# EAGLE design Voicecard-SMR-v04 (EAGLE 5.09)
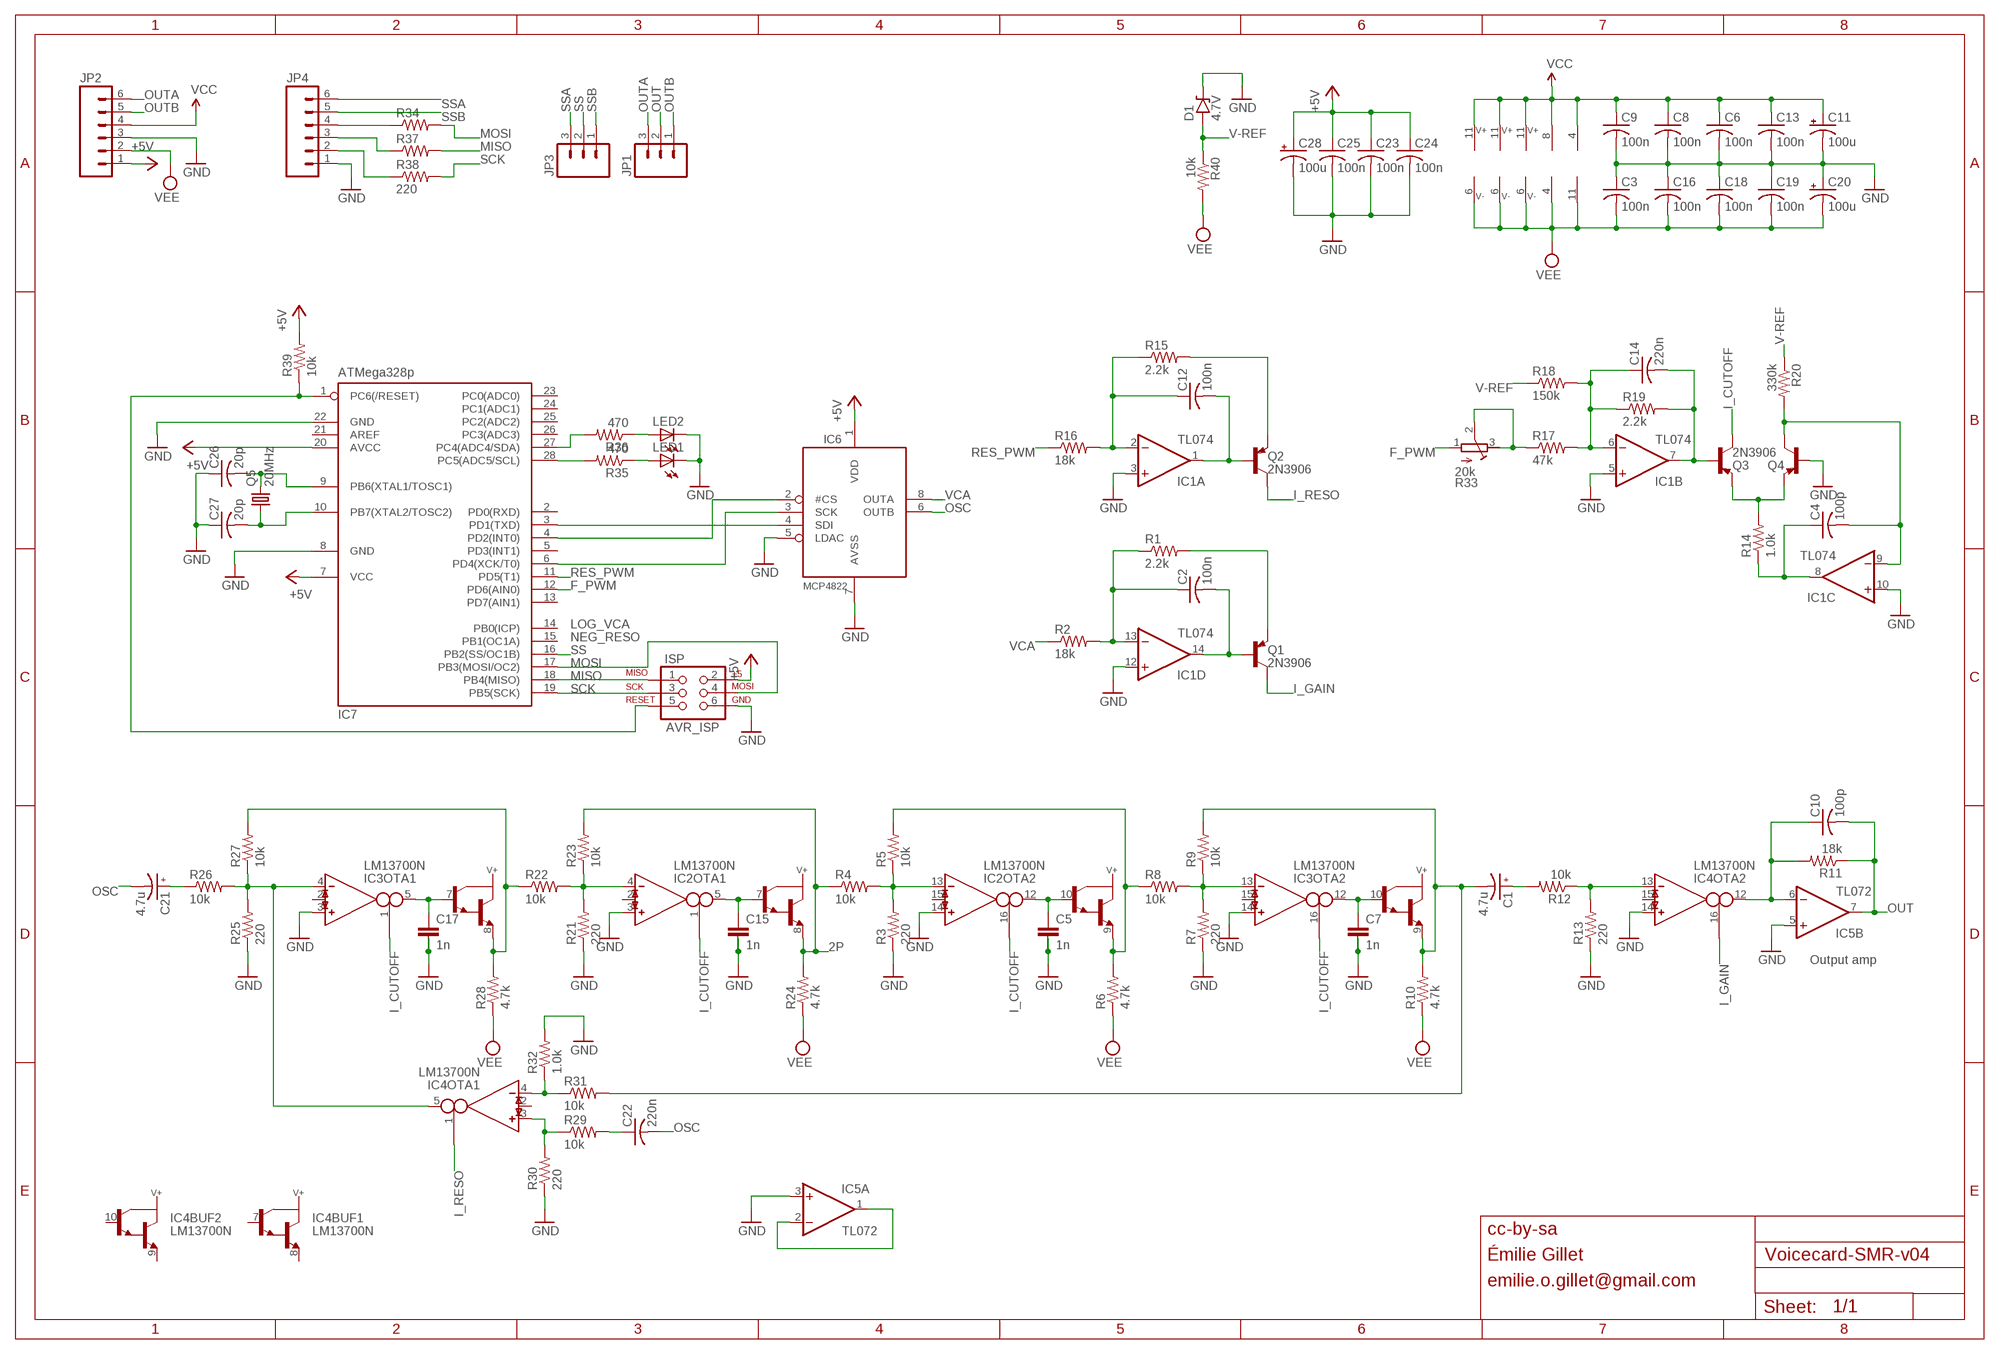
[diagram p0: schematic, sheet 1]

## Parts
C1  4.7u  CPOL-USE11-6.3  [E11-6.3]
C2  100n  C-US025-025X050  [C025-025X050]
C3  100n  C-US025-025X050  [C025-025X050]
C4  100p  C-US025-025X050  [C025-025X050]
C5  1n  C-2.5-5/2  [C2.5/5-2]
C6  100n  C-US025-025X050  [C025-025X050]
C7  1n  C-2.5-5/2  [C2.5/5-2]
C8  100n  C-US025-025X050  [C025-025X050]
C9  100n  C-US025-025X050  [C025-025X050]
C10  100p  C-US025-025X050  [C025-025X050]
C11  100u  CPOL-USE2.5-6  [E2,5-6]
C12  100n  C-US025-025X050  [C025-025X050]
C13  100n  C-US025-025X050  [C025-025X050]
C14  220n  C-US025-025X050  [C025-025X050]
C15  1n  C-2.5-5/2  [C2.5/5-2]
C16  100n  C-US025-025X050  [C025-025X050]
C17  1n  C-2.5-5/2  [C2.5/5-2]
C18  100n  C-US025-025X050  [C025-025X050]
C19  100n  C-US025-025X050  [C025-025X050]
C20  100u  CPOL-USE2.5-6  [E2,5-6]
C21  4.7u  CPOL-USE11-6.3  [E11-6.3]
C22  220n  C-US025-025X050  [C025-025X050]
C23  100n  C-US025-025X050  [C025-025X050]
C24  100n  C-US025-025X050  [C025-025X050]
C25  100n  C-US025-024X044  [C025-024X044]
C26  20p  C-US025-024X044  [C025-024X044]
C27  20p  C-US025-024X044  [C025-024X044]
C28  100u  CPOL-USE2.5-6  [E2,5-6]
D1  4.7V  1N47XXDO35  [D-5]
IC1  TL074  TL084P  [DIL14]
IC2  LM13700N  [DIL16]
IC3  LM13700N  [DIL16]
IC4  LM13700N  [DIL16]
IC5  TL072  TL072P  [DIL08]
IC6  MCP4822  [DIL08]
IC7  ATMega328p  MEGA8-P  [DIL28-3]
ISP  AVR_ISP  AVR_SPI_PRG_6PTH  [2X3]
JP1  M03PTH  [1X03]
JP2  M06SIP  [1X06]
JP3  M03PTH  [1X03]
JP4  M06SIP  [1X06]
LED1  LED3MM  [LED3MM]
LED2  LED3MM  [LED3MM]
Q1  2N3906  2N3906-  [TO92-]
Q2  2N3906  2N3906-  [TO92-]
Q3  2N3906  2N3906-  [TO92-]
Q4  2N3906  2N3906-  [TO92-]
Q5  20MHz  CRYSTALHC49U-V  [HC49U-V]
R1  2.2k  R-US_0204/7  [0204/7]
R2  18k  R-US_0204/7  [0204/7]
R3  220  R-US_0204/7  [0204/7]
R4  10k  R-US_0204/7  [0204/7]
R5  10k  R-US_0204/7  [0204/7]
R6  4.7k  R-US_0204/7  [0204/7]
R7  220  R-US_0204/7  [0204/7]
R8  10k  R-US_0204/7  [0204/7]
R9  10k  R-US_0204/7  [0204/7]
R10  4.7k  R-US_0204/7  [0204/7]
R11  18k  R-US_0204/7  [0204/7]
R12  10k  R-US_0204/7  [0204/7]
R13  220  R-US_0204/7  [0204/7]
R14  1.0k  R-US_0204/7  [0204/7]
R15  2.2k  R-US_0204/7  [0204/7]
R16  18k  R-US_0204/7  [0204/7]
R17  47k  R-US_0204/7  [0204/7]
R18  150k  R-US_0204/7  [0204/7]
R19  2.2k  R-US_0204/7  [0204/7]
R20  330k  R-US_0204/7  [0204/7]
R21  220  R-US_0204/7  [0204/7]
R22  10k  R-US_0204/7  [0204/7]
R23  10k  R-US_0204/7  [0204/7]
R24  4.7k  R-US_0204/7  [0204/7]
R25  220  R-US_0204/7  [0204/7]
R26  10k  R-US_0204/7  [0204/7]
R27  10k  R-US_0204/7  [0204/7]
R28  4.7k  R-US_0204/7  [0204/7]
R29  10k  R-US_0204/7  [0204/7]
R30  220  R-US_0204/7  [0204/7]
R31  10k  R-US_0204/7  [0204/7]
R32  1.0k  R-US_0204/7  [0204/7]
R33  20k  R-TRIMM3296P  [RTRIM3296P]
R34  220  R-US_0204/7  [0204/7]
R35  470  R-US_0204/7  [0204/7]
R36  470  R-US_0204/7  [0204/7]
R37  220  R-US_0204/7  [0204/7]
R38  220  R-US_0204/7  [0204/7]
R39  10k  R-US_0204/7  [0204/7]
R40  10k  R-US_0204/7  [0204/7]

## Nets
2P: IC2.8(BUF1:E) R4.1 R23.2 R24.2
4P: C1.- IC3.9(BUF2:E) R9.2 R10.2 R31.2
+5V: C23.1 C24.1 C25.1 C28.+ IC6.1(VDD) IC7.7(VCC) IC7.20(AVCC) ISP.2 JP2.1 R39.2
F_PWM: IC7.12(PD6(AIN0)) R33.1(E)
GND: C3.1 C5.2 C5.3 C6.2 C7.2 C7.3 C8.2 C9.2 C11.- C13.2 C15.2 C15.3 C16.1 C17.2 C17.3 C18.1 C19.1 C20.+ C23.2 C24.2 C25.2 C26.1 C27.1 C28.- D1.C IC1.3(A:+IN) IC1.5(B:+IN) IC1.10(C:+IN) IC1.12(D:+IN) IC2.3(OTA1:IN_P) IC2.14(OTA2:IN_P) IC3.3(OTA1:IN_P) IC3.14(OTA2:IN_P) IC4.14(OTA2:IN_P) IC5.3(A:+IN) IC5.5(B:+IN) IC6.5(LDAC) IC6.7(AVSS) IC7.8(GND) IC7.22(GND) ISP.6 JP2.3 JP4.1 LED1.K(C) LED2.K(C) Q4.2(B) R3.1 R7.1 R13.1 R21.1 R25.1 R30.1 R32.2
I_CUTOFF: IC2.1(OTA1:I_BIAS) IC2.16(OTA2:I_BIAS) IC3.1(OTA1:I_BIAS) IC3.16(OTA2:I_BIAS) Q3.1(C)
I_GAIN: IC4.16(OTA2:I_BIAS) Q1.1(C)
I_RESO: IC4.1(OTA1:I_BIAS) Q2.1(C)
MISO: IC7.18(PB4(MISO)) ISP.1 R37.2
MOSI: IC7.17(PB3(MOSI/OC2)) ISP.4 R34.2
N$1: Q3.3(E) Q4.3(E) R14.2
N$2: C14.2 IC1.7(B:OUT) Q3.2(B) R19.2
N$3: IC6.4(SDI) IC7.3(PD1(TXD))
N$4: C4.2 IC1.9(C:-IN) Q4.1(C) R20.2
N$5: C21.+ R26.1
N$6: IC3.8(BUF1:E) R22.1 R27.2 R28.2
N$7: LED1.A R35.1
N$8: JP4.2 R38.1
N$9: C4.1 IC1.8(C:OUT) R14.1
N$10: LED2.A R36.1
N$11: IC7.27(PC4(ADC4/SDA)) R36.2
N$12: IC3.4(OTA1:IN_N) IC4.5(OTA1:OUT) R25.2 R26.2 R27.1
N$13: JP4.3 R37.1
N$14: IC7.1(PC6(/RESET)) ISP.5 R39.1
N$15: IC6.3(SCK) IC7.6(PD4(XCK/T0))
N$16: IC6.2(#CS) IC7.4(PD2(INT0))
N$17: IC2.4(OTA1:IN_N) R21.2 R22.2 R23.1
N$18: JP4.4 R34.1
N$19: C15.1 IC2.5(OTA1:OUT) IC2.7(BUF1:B)
N$20: IC7.28(PC5(ADC5/SCL)) R35.2
N$21: IC2.13(OTA2:IN_N) R3.2 R4.2 R5.1
N$22: IC5.1(A:OUT) IC5.2(A:-IN)
N$23: C5.1 IC2.10(BUF2:B) IC2.12(OTA2:OUT)
N$24: IC3.13(OTA2:IN_N) R7.2 R8.2 R9.1
N$26: IC2.9(BUF2:E) R5.2 R6.2 R8.1
N$27: C1.+ R12.2
N$28: C7.1 IC3.10(BUF2:B) IC3.12(OTA2:OUT)
N$29: IC4.4(OTA1:IN_N) R31.1 R32.1
N$30: C12.2 IC1.1(A:OUT) Q2.2(B)
N$31: C2.2 IC1.14(D:OUT) Q1.2(B)
N$32: C22.1 R29.2
N$33: IC4.3(OTA1:IN_P) R29.1 R30.2
N$34: IC4.13(OTA2:IN_N) R12.1 R13.2
N$40: C14.1 IC1.6(B:-IN) R17.2 R18.2 R19.1
N$41: R17.1 R33.2(S) R33.3(A)
N$51: C2.1 IC1.13(D:-IN) R1.1 R2.2
N$57: C12.1 IC1.2(A:-IN) R15.1 R16.2
N$60: Q2.3(E) R15.2
N$64: C17.1 IC3.5(OTA1:OUT) IC3.7(BUF1:B)
N$68: Q1.3(E) R1.2
N$70: C10.1 IC4.12(OTA2:OUT) IC5.6(B:-IN) R11.2
N$82: C27.2 IC7.10(PB7(XTAL2/TOSC2)) Q5.1
N$83: C26.2 IC7.9(PB6(XTAL1/TOSC1)) Q5.2
OSC: C21.- C22.2 IC6.6(OUTB)
OUT: C10.2 IC5.7(B:OUT) JP1.2 R11.1
OUTA: JP1.3 JP2.6
OUTB: JP1.1 JP2.5
RES_PWM: IC7.11(PD5(T1)) R16.1
SCK: IC7.19(PB5(SCK)) ISP.3 R38.2
SS: IC7.16(PB2(SS/OC1B)) JP3.2
SSA: JP3.3 JP4.6
SSB: JP3.1 JP4.5
V-REF: D1.A R18.1 R20.1 R40.1
VCA: IC6.8(OUTA) R2.1
VCC: C6.1 C8.1 C9.1 C11.+ C13.1 IC1.4(P:V+) IC2.11(SUPPLY:V+) IC3.11(SUPPLY:V+) IC4.11(SUPPLY:V+) IC5.8(P:V+) JP2.4
VEE: C3.2 C16.2 C18.2 C19.2 C20.- IC1.11(P:V-) IC2.6(SUPPLY:V-) IC3.6(SUPPLY:V-) IC4.6(SUPPLY:V-) IC5.4(P:V-) JP2.2 R6.1 R10.1 R24.1 R28.1 R40.2
Unconnected: IC2.2(OTA1:I_DIODE) IC2.15(OTA2:I_DIODE) IC3.2(OTA1:I_DIODE) IC3.15(OTA2:I_DIODE) IC4.2(OTA1:I_DIODE) IC4.7(BUF1:B) IC4.8(BUF1:E) IC4.9(BUF2:E) IC4.10(BUF2:B) IC4.15(OTA2:I_DIODE) IC7.2(PD0(RXD)) IC7.5(PD3(INT1)) IC7.13(PD7(AIN1)) IC7.14(PB0(ICP)) IC7.15(PB1(OC1A)) IC7.21(AREF) IC7.23(PC0(ADC0)) IC7.24(PC1(ADC1)) IC7.25(PC2(ADC2)) IC7.26(PC3(ADC3))

## Notes on the sheet
- LOG_VCA
- NEG_RESO
- Output amp
- cc-by-sa
- Émilie Gillet
- emilie.o.gillet@gmail.com

## Library data of the parts
C1 C21 = og-rcl:CPOL-US
C2-C4 C6 C8-C10 C12-C14 C16 C18 C19 C22-C27 = rcl:C-US: CAPACITOR, American symbol
C5 C7 C15 C17 = capacitor-wima:C-: CAPACITOR for alternative placement naming: default grid - extended grid/package width
C11 C20 C28 = rcl:CPOL-US: POLARIZED CAPACITOR, American symbol
D1 = og-diodes:1N47XX: Zener Diode 1N4728 - 1N4764: 3.3 V - 100V, 10% (1n47xxA 5%); DO-41 glass case
IC1 = linear:TL084: OP AMP
IC2-IC4 = ota:LM13700: Dual OTA with buffers
IC5 = gm-ics:TL072: OP AMP
IC6 = og-dac:MCP4822
IC7 = atmel:MEGA8-P: MICROCONTROLLER 8 Kbytes FLASH, 1 kbytes SRAM, 512 bytes EEPROM, USART, 4-channel 10 bit ADC, 2-channel 8 bit ADC Pin compatible with Atmega48, ATMega88, ATMega168 Source: avr.lbr
ISP = SparkFun:AVR_SPI_PRG_6: AVR ISP 6 Pin This is the reduced ISP connector for AVR programming. Common on Arduino. This footprint will take up less PCB space and can be used with a 10-pin to 6-pin adapter such as SKU: BOB-08508
JP1 JP3 = SparkFun:M03: Header 3 Standard 3-pin 0.1" header. Use with straight break away headers (SKU : PRT-00116), right angle break away headers (PRT-00553), swiss pins (PRT-00743), machine pins (PRT-00117), and female headers (PRT-00115). Molex polarized connector foot print use with SKU : PRT-08232 with associated crimp pins and housings.
JP2 JP4 = SparkFun:M06: Header 6 Standard 6-pin 0.1" header. Use with straight break away headers (SKU : PRT-00116), right angle break away headers (PRT-00553), swiss pins (PRT-00743), machine pins (PRT-00117), and female headers (PRT-00115). Molex polarized connector foot print use with SKU : PRT-08094 with associated crimp pins and housings. NOTES ON THE VARIANTS LOCK and LOCK_LONGPADS... This footprint was designed to help hold the alignment of a through-hole component (i.e. 6-pin header) while soldering it into place. You may notice that each hole has been shifted either up or down by 0.005 of an inch from it's more standard position (which is a perfectly straight line). This slight alteration caused the pins (the squares in the middle) to touch the edges of the holes. Because they are alternating, it causes a "brace" to hold the component in place. 0.005 has proven to be the perfect amount of "off-center" position when using our standard breakaway headers. Although looks a little odd when you look at the bare footprint, once you have a header in there, the alteration is very hard to notice. Also, if you push a header all the way into place, it is covered up entirely on the bottom side. This idea of altering the position of holes to aid alignment will be further integrated into the Sparkfun Library for other footprints. It can help hold any component with 3 or more connection pins.
LED1 LED2 = led:LED: LED OSRAM: - CHIPLED LG R971, LG N971, LY N971, LG Q971, LY Q971, LO R971, LY R971 LH N974, LH R974 LS Q976, LO Q976, LY Q976 LO Q996 - Hyper CHIPLED LW Q18S LB Q993, LB Q99A, LB R99A - SideLED LS A670, LO A670, LY A670, LG A670, LP A670 LB A673, LV A673, LT A673, LW A673 LH A674 LY A675 LS A676, LA A676, LO A676, LY A676, LW A676 LS A679, LY A679, LG A679 - Hyper Micro SIDELED® LS Y876, LA Y876, LO Y876, LY Y876 LT Y87S - SmartLED LW L88C, LW L88S LB L89C, LB L89S, LG L890 LS L89K, LO L89K, LY L89K LS L896, LA L896, LO L896, LY L896 - TOPLED LS T670, LO T670, LY T670, LG T670, LP T670 LSG T670, LSP T670, LSY T670, LOP T670, LYG T670 LG T671, LOG T671, LSG T671 LB T673, LV T673, LT T673, LW T673 LH T674 LS T676, LA T676, LO T676, LY T676, LB T676, LH T676, LSB T676, LW T676 LB T67C, LV T67C, LT T67C, LS T67K, LO T67K, LY T67K, LW E67C LS E67B, LA E67B, LO E67B, LY E67B, LB E67C, LV E67C, LT E67C LW T67C LS T679, LY T679, LG T679 LS T770, LO T770, LY T770, LG T770, LP T770 LB T773, LV T773, LT T773, LW T773 LH T774 LS E675, LA E675, LY E675, LS T675 LS T776, LA T776, LO T776, LY T776, LB T776 LHGB T686 LT T68C, LB T68C - Hyper Mini TOPLED® LB M676 - Mini TOPLED Santana® LG M470 LS M47K, LO M47K, LY M47K Source: http://www.osram.convergy.de LUXEON: - LUMILED® LXK2-PW12-R00, LXK2-PW12-S00, LXK2-PW14-U00, LXK2-PW14-V00 LXK2-PM12-R00, LXK2-PM12-S00, LXK2-PM14-U00 LXK2-PE12-Q00, LXK2-PE12-R00, LXK2-PE12-S00, LXK2-PE14-T00, LXK2-PE14-U00 LXK2-PB12-K00, LXK2-PB12-L00, LXK2-PB12-M00, LXK2-PB14-N00, LXK2-PB14-P00, LXK2-PB14-Q00 LXK2-PR12-L00, LXK2-PR12-M00, LXK2-PR14-Q00, LXK2-PR14-R00 LXK2-PD12-Q00, LXK2-PD12-R00, LXK2-PD12-S00 LXK2-PH12-R00, LXK2-PH12-S00 LXK2-PL12-P00, LXK2-PL12-Q00, LXK2-PL12-R00 Source: www.luxeon.com KINGBRIGHT: KA-3528ASYC Source: www.kingbright.com
Q1-Q4 = gm-trans:2N3906: PNP Transistor
Q5 = crystal:CRYSTAL: CRYSTAL
R1-R32 R34-R40 = rcl:R-US_: RESISTOR, American symbol
R33 = rcl:R-TRIMM: Trimm resistor

## Board
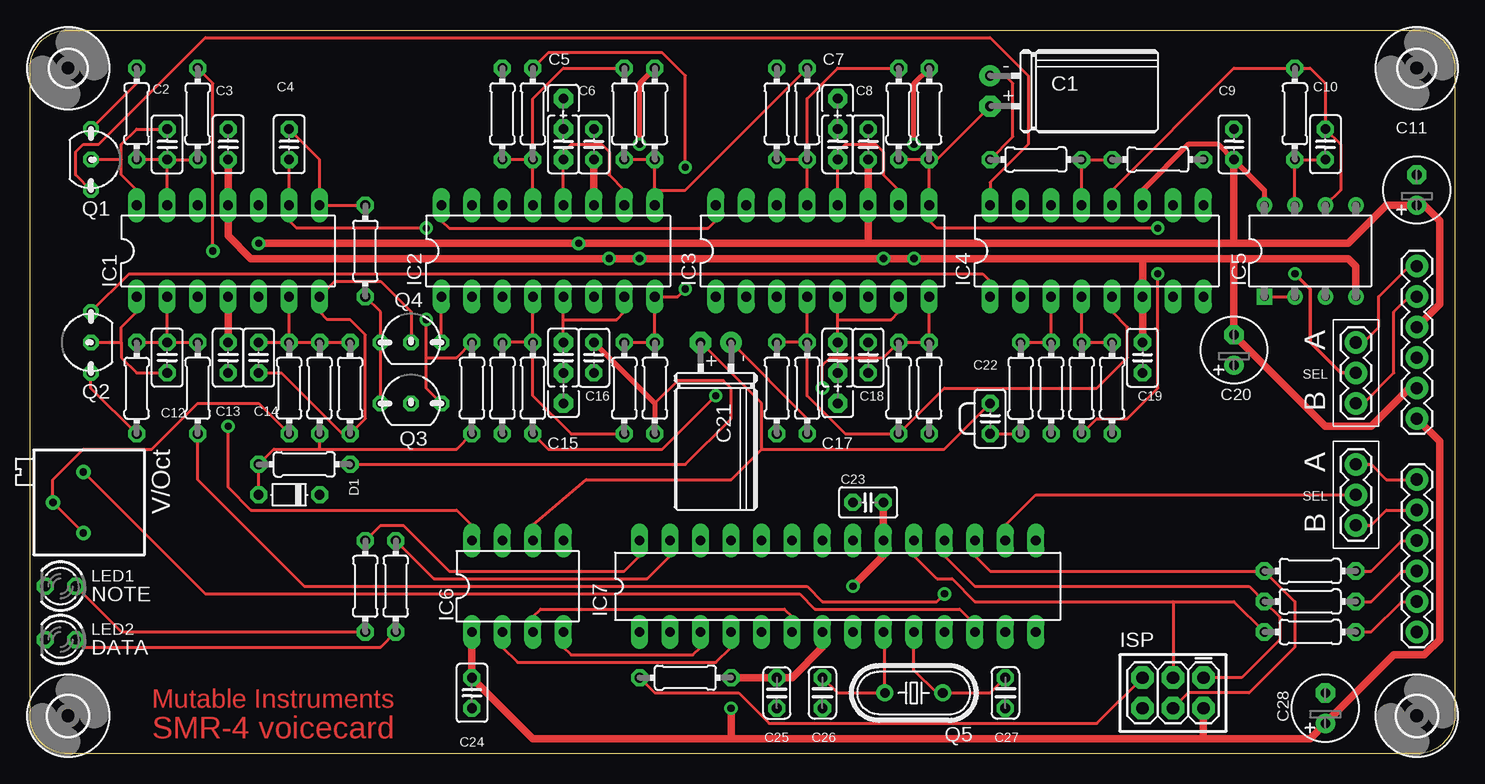
[diagram p1: board, top side]
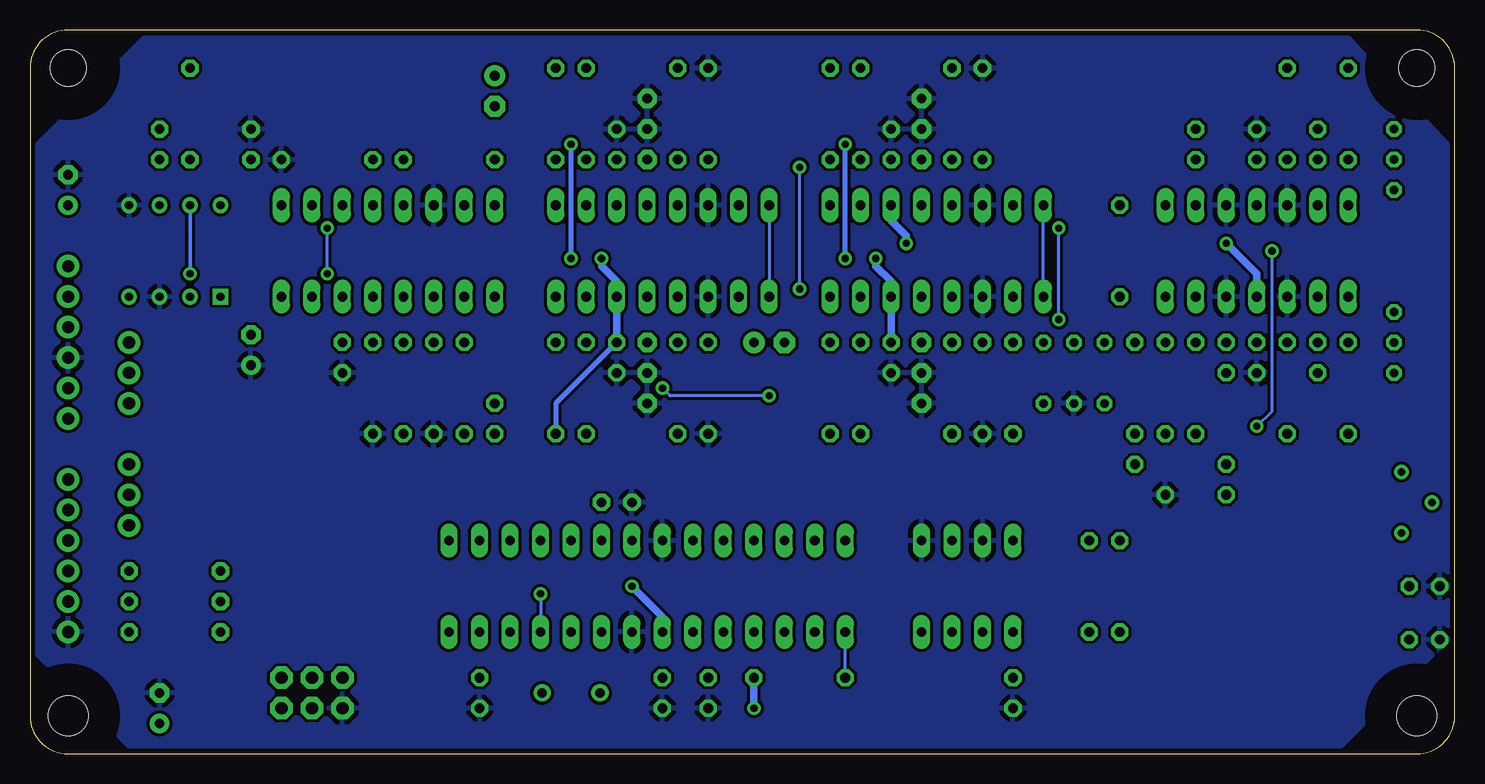
[diagram p2: board, bottom side, seen from below]

Size 118.75 x 60.33 mm. Coordinates in mm from the lower left corner, seen from the top.
Outline: 0,57.15 arc-90 3.17,60.33 115.57,60.33 arc-90 118.75,57.15 118.75,3.17 arc-90 115.57,0 3.17,0 arc-90 0,3.17 0,57.15
Copper layers (1*16): Top 0.035mm / dielectric 1.5mm / Bottom 0.035mm
Design rules "SparkFun *": minimum track width 8mil, minimum drill 20mil, track to track 8mil, track to pad 8mil, pad to pad 8mil, via to via 8mil, smd to smd 8mil, copper to edge 10mil, drill to drill 8mil, minimum pad ring 12mil, minimum via ring 10mil, stop-mask expansion 4mil, vias tented up to drill 25mil, thermal gap 16mil

### Footprints (pad centres in the part's own frame; a part is rotated, then mirrored left to right if it is on the bottom)
E11-6.3 = drill 0.813 pad 1.778 round: + -2.54,1.27 | drill 0.813 pad 1.778 octagon: - -2.54,-1.27
C025-025X050 = drill 0.813 octagon: 1 -1.27,0; 2 1.27,0
C2.5/5-2 = drill 0.813 pad 1.6 octagon: 1 -1.27,0; 2 1.27,0; 3 3.81,0
E2,5-6 = drill 0.813 pad 1.6 round: + -1.27,0 | drill 0.813 pad 1.6 octagon: - 1.27,0
C025-024X044 = drill 0.813 octagon: 1 -1.27,0; 2 1.27,0
D-5 = drill 0.813 octagon: A 2.54,0; C -2.54,0
DIL14 = drill 0.813 long: 1 -7.62,-3.81; 2 -5.08,-3.81; 3 -2.54,-3.81; 4 0,-3.81; 5 2.54,-3.81; 6 5.08,-3.81; 7 7.62,-3.81; 8 7.62,3.81; 9 5.08,3.81; 10 2.54,3.81; 11 0,3.81; 12 -2.54,3.81; 13 -5.08,3.81; 14 -7.62,3.81
DIL16 = drill 0.813 long: 1 -8.89,-3.81; 2 -6.35,-3.81; 3 -3.81,-3.81; 4 -1.27,-3.81; 5 1.27,-3.81; 6 3.81,-3.81; 7 6.35,-3.81; 8 8.89,-3.81; 9 8.89,3.81; 10 6.35,3.81; 11 3.81,3.81; 12 1.27,3.81; 13 -1.27,3.81; 14 -3.81,3.81; 15 -6.35,3.81; 16 -8.89,3.81
DIL08 = drill 0.7 square: 1 -3.81,-3.81 | drill 0.7 round: 2 -1.27,-3.81; 3 1.27,-3.81; 4 3.81,-3.81; 5 3.81,3.81; 6 1.27,3.81; 7 -1.27,3.81; 8 -3.81,3.81
DIL08' = drill 0.813 long: 1 -3.81,-3.81; 2 -1.27,-3.81; 3 1.27,-3.81; 4 3.81,-3.81; 5 3.81,3.81; 6 1.27,3.81; 7 -1.27,3.81; 8 -3.81,3.81
DIL28-3 = drill 0.813 long: 1 -16.51,-3.81; 2 -13.97,-3.81; 3 -11.43,-3.81; 4 -8.89,-3.81; 5 -6.35,-3.81; 6 -3.81,-3.81; 7 -1.27,-3.81; 8 1.27,-3.81; 9 3.81,-3.81; 10 6.35,-3.81; 11 8.89,-3.81; 12 11.43,-3.81; 13 13.97,-3.81; 14 16.51,-3.81; 15 16.51,3.81; 16 13.97,3.81; 17 11.43,3.81; 18 8.89,3.81; 19 6.35,3.81; 20 3.81,3.81; 21 1.27,3.81; 22 -1.27,3.81; 23 -3.81,3.81; 24 -6.35,3.81; 25 -8.89,3.81; 26 -11.43,3.81; 27 -13.97,3.81; 28 -16.51,3.81
2X3 = drill 1.016 pad 1.88 octagon: 1 0,0; 2 0,2.54; 3 2.54,0; 4 2.54,2.54; 5 5.08,0; 6 5.08,2.54
1X03 = drill 1.016 pad 1.88 round: 1 0,0; 2 2.54,0; 3 5.08,0
1X06 = drill 1.016 pad 1.88 round: 1 0,0; 2 2.54,0; 3 5.08,0; 4 7.62,0; 5 10.16,0; 6 12.7,0
LED3MM = drill 0.813 octagon: A -1.27,0; K 1.27,0
TO92- = drill 0.7 octagon: 1 2.54,0; 2 0,0; 3 -2.54,0
HC49U-V = drill 0.813 round: 1 -2.413,0; 2 2.413,0
0204/7 = drill 0.813 octagon: 1 -3.81,0; 2 3.81,0
RTRIM3296P = drill 0.61 round: 1 0,-2.54; 2 2.54,0; 3 0,2.54
3,0 = hole 3: 0,0
3,3 = hole 3.3: 0,0

### Placement (x,y rotation side)
C1  82.55,55.25 0 top
C2  11.43,50.8 90 top
C3  16.51,50.8 270 top
C4  21.59,50.8 270 top
C5  44.45,50.8 90 top
C6  46.99,50.8 90 top
C7  67.31,50.8 90 top
C8  69.85,50.8 90 top
C9  100.33,50.8 90 top
C10  107.95,50.8 270 top
C11  115.57,46.99 90 top
C12  11.43,33.02 270 top
C13  16.51,33.02 270 top
C14  19.05,33.02 270 top
C15  44.45,33.02 270 top
C16  46.99,33.02 90 top
C17  67.31,33.02 270 top
C18  69.85,33.02 90 top
C19  92.71,33.02 90 top
C20  100.33,33.66 90 top
C21  57.15,31.75 270 top
C22  80.01,27.94 90 top
C23  69.85,20.95 180 top
C24  36.83,5.08 270 top
C25  62.23,5.08 270 top
C26  66.04,5.08 90 top
C27  81.28,5.08 90 top
C28  107.95,3.81 90 top
D1  21.59,21.59 180 top
IC1  16.51,41.91 0 top
IC2  43.18,41.91 0 top
IC3  66.04,41.91 0 top
IC4  88.9,41.91 0 top
IC5  106.68,41.91 0 top
IC6  MCP4822  [DIL08']  40.64,13.97 0 top
IC7  67.31,13.97 0 top
ISP  97.79,6.35 180 top
JP1  110.49,29.21 90 top
JP2  115.57,27.94 90 top
JP3  110.49,19.05 90 top
JP4  115.57,10.16 90 top
LED1  2.54,13.97 180 top
LED2  2.54,9.53 180 top
Q1  5.08,49.53 270 top
Q2  5.08,34.29 90 top
Q3  31.75,34.29 0 top
Q4  31.75,29.21 0 top
Q5  73.66,5.08 180 top
R1  8.89,53.34 90 top
R2  13.97,53.34 270 top
R3  39.37,53.34 270 top
R4  41.91,53.34 270 top
R5  49.53,53.34 270 top
R6  52.07,53.34 270 top
R7  62.23,53.34 270 top
R8  64.77,53.34 270 top
R9  72.39,53.34 270 top
R10  74.93,53.34 270 top
R11  105.41,53.34 90 top
R12  83.82,49.53 180 top
R13  93.98,49.53 180 top
R14  27.94,41.91 270 top
R15  8.89,30.48 270 top
R16  13.97,30.48 90 top
R17  21.59,30.48 90 top
R18  24.13,30.48 90 top
R19  26.67,30.48 270 top
R20  36.83,30.48 90 top
R21  39.37,30.48 90 top
R22  41.91,30.48 90 top
R23  49.53,30.48 90 top
R24  52.07,30.48 90 top
R25  62.23,30.48 90 top
R26  64.77,30.48 90 top
R27  72.39,30.48 90 top
R28  74.93,30.48 90 top
R29  82.55,30.48 270 top
R30  85.09,30.48 90 top
R31  87.63,30.48 270 top
R32  90.17,30.48 270 top
R33  4.45,20.95 180 top
R34  106.68,15.24 180 top
R35  27.94,13.97 90 top
R36  30.48,13.97 90 top
R37  106.68,12.7 180 top
R38  106.68,10.16 180 top
R39  54.61,6.35 0 top
R40  22.86,24.13 0 top
U$1  [3,0]  3.17,57.15 0 top
U$2  [3,0]  115.57,57.15 0 top
U$4  [3,3]  3.17,3.17 0 top
U$5  [3,3]  115.57,3.17 0 top
U$6  [V2_LOGO_SMALL]  8.26,-3.81 0 top  (outside the outline)

### Tracks (layer width: path | path; a pad name or v marks a point on that pad's centre or on a via)
2P  (via drill 0.6)
  Top 0.254: R23.2 R24.2 IC2.8 53.98,38.1 v54.61,38.74 | R4.1 43.18,58.42 52.7,58.42 54.61,56.52 v54.61,48.9
  Bottom 0.254: v54.61,38.74 v54.61,48.9
4P  (via drill 0.6)
  Top 0.254: R10.2 R9.2 | R10.2 IC3.9 74.93,44.45 75.56,43.82 v93.98,43.82 | R10.2 74.93,50.17 | v93.98,40.01 93.98,30.48 91.44,27.94 88.9,27.94 R31.2 | R10.2 75.56,49.53 C1.-
  Bottom 0.254: v93.98,40.01 v93.98,43.82
+5V  (via drill 0.6)
  Top 0.61: 58.42,1.27 41.91,1.27 C24.1 IC6.1 | 58.42,1.27 v58.42,3.81 | 58.42,1.27 97.79,1.27 | 97.79,1.27 106.68,1.27 C28.+ 113.67,8.26 116.2,8.26 117.47,9.53 117.47,26.04 JP2.1 | R39.2 C25.1 63.5,6.35 66.04,8.89 IC7.7 | v68.58,13.97 71.12,16.51 IC7.20 C23.1 | 97.79,1.27 ISP.2
  Bottom 0.61: v58.42,3.81 R39.2 | IC7.7 66.04,11.43 v68.58,13.97
F_PWM
  Top 0.254: IC7.12 78.74,10.79 77.47,12.06 65.41,12.06 64.14,13.33 14.61,13.33 R33.1
GND
  pour Bottom (isolate 0.254): 8.89,59.69 0.64,50.8 0.64,9.53 9.53,0.64 110.49,0.64 118.11,8.26 118.11,50.8 109.22,59.69
I_CUTOFF
  Top 0.254: Q3.1 IC2.1 | IC3.16 57.15,44.45 56.52,43.82 34.92,43.82 34.29,44.45 IC2.16
  Bottom 0.254: IC3.16 IC3.1 | IC2.1 IC2.16
I_GAIN
  Top 0.254: Q1.1 3.81,48.26 3.81,50.17 4.45,50.8 5.71,50.8 14.61,59.69 80.01,59.69 83.19,56.52 83.19,50.8 80.01,47.62 IC4.16 80.01,46.99
I_RESO
  Top 0.254: IC4.1 80.01,39.37 79.38,40.01 8.26,40.01 Q2.1
MISO
  Top 0.254: IC7.18 76.2,16.51 78.74,13.97 101.6,13.97 R37.2 104.14,11.43 104.14,9.53 100.97,6.35 ISP.1
MOSI
  Top 0.254: IC7.17 78.74,16.51 80.01,15.24 R34.2 105.41,12.7 105.41,8.89 101.6,5.08 96.52,5.08 ISP.4
N$1
  Top 0.254: Q4.3 Q3.3 29.21,36.83 R14.2
N$2
  Top 0.254: C14.2 20.95,31.75 26.04,26.67 R19.2 27.94,27.94 27.94,34.93 26.67,36.2 24.77,36.2 24.13,36.83 IC1.7 25.4,39.37 29.21,39.37 31.75,36.83 Q3.2
N$3
  Top 0.254: IC7.3 55.88,8.89 55.24,8.26 45.09,8.26 44.45,8.89 IC6.4
N$4  (via drill 0.6)
  Top 0.254: C4.2 IC1.9 21.59,44.45 22.23,43.82 v33.02,43.82 | Q4.1 33.02,30.48 33.02,33.02 | 33.02,33.02 v33.02,36.2 | R20.2 35.56,33.02 33.02,33.02
  Bottom 0.254: v33.02,36.2 v33.02,43.82
N$5
  Top 0.254: C21.+ 64.77,27.94 R26.1
N$6  (via drill 0.6)
  Top 0.254: IC3.8 R28.2 R27.2 71.12,33.02 66.67,33.02 66.04,32.38 v66.04,30.48 | R22.1 43.18,25.4 52.7,25.4 v57.15,29.84
  Bottom 0.254: v57.15,29.84 65.41,29.84 v66.04,30.48
N$7
  Top 0.254: R35.1 7.62,10.16 LED1.A
N$8
  Top 0.254: R38.1 111.76,10.16 114.3,12.7 JP4.2
N$9
  Top 0.254: C4.1 24.13,49.53 IC1.8 R14.1
N$10
  Top 0.254: R36.1 29.21,8.89 4.45,8.89 LED2.A
N$11
  Top 0.254: R36.2 33.66,14.61 51.44,14.61 53.34,16.51 IC7.27
N$12
  Top 0.254: IC4.5 90.17,36.83 91.44,35.56 91.44,33.02 88.9,30.48 76.2,30.48 R27.1 67.94,26.67 64.77,29.84 R26.2 | R26.2 R25.2 | R26.2 IC3.4
N$13
  Top 0.254: R37.1 111.76,12.7 114.3,15.24 JP4.3
N$14
  Top 0.254: R39.1 52.07,5.08 59.05,5.08 61.59,2.54 88.9,2.54 ISP.5
  Bottom 0.254: R39.1 IC7.1
N$15
  Top 0.254: IC7.6 63.5,11.43 62.87,12.06 42.55,12.06 41.91,11.43 IC6.3
N$16
  Top 0.254: IC7.4 58.42,8.89 57.15,7.62 40.64,7.62 39.37,8.89 IC6.2
N$17
  Top 0.254: R22.2 R21.2 | R23.1 45.09,26.67 41.91,29.84 R22.2 | R22.2 IC2.4
N$18
  Top 0.254: R34.1 111.76,15.24 114.3,17.78 JP4.4
N$19
  Top 0.254: 44.45,36.2 IC2.5 | C15.1 44.45,36.2 | IC2.7 49.53,36.83 48.9,36.2 44.45,36.2
N$20
  Top 0.254: R35.2 29.21,19.05 31.11,19.05 34.92,15.24 49.53,15.24 50.8,16.51 IC7.28
N$21
  Top 0.254: R4.2 R3.2 | IC2.13 R4.2 | R4.2 41.91,54.61 44.45,57.15 R5.1
N$22
  Top 0.254: IC5.1 IC5.2
N$23
  Top 0.254: IC2.12 C5.1 44.45,50.17 45.09,50.8 47.62,50.8 48.26,50.17 48.26,48.26 49.53,46.99 IC2.10
N$24
  Top 0.254: R9.1 67.31,57.15 64.77,54.61 R8.2 | R8.2 R7.2 | IC3.13 R8.2
N$26
  Top 0.254: R5.2 R6.2 52.07,46.99 | IC2.9 52.07,46.99 | R8.1 54.61,46.99 52.07,46.99
N$27
  Top 0.254: C1.+ 81.28,56.52 81.92,55.88 81.92,51.44 R12.2
N$28
  Top 0.254: IC3.12 C7.1 67.31,50.17 67.94,50.8 70.48,50.8 71.12,50.17 71.12,48.26 72.39,46.99 IC3.10
N$29
  Top 0.254: IC4.4 R31.1 R32.1
N$30
  Top 0.254: IC1.1 8.89,36.83 7.62,35.56 7.62,34.29 | 7.62,34.29 7.62,33.02 8.89,31.75 C12.2 | Q2.2 7.62,34.29
N$31
  Top 0.254: IC1.14 8.89,46.99 7.62,48.26 7.62,49.53 | 7.62,49.53 7.62,50.8 8.89,52.07 C2.2 | 7.62,49.53 Q1.2
N$32
  Top 0.254: C22.1 R29.2
N$33
  Top 0.254: IC4.3 R30.2 R29.1
N$34
  Top 0.254: R13.2 R12.1 IC4.13
N$40
  Top 0.254: R17.2 IC1.6 | C14.1 R17.2 | R17.2 R18.2 R19.1
N$41
  Top 0.254: R17.1 19.05,29.21 13.97,29.21 10.16,25.4 4.45,25.4 1.91,22.86 R33.2 R33.3
N$51
  Top 0.254: C2.1 R1.1 | C2.1 R2.2 | IC1.13 C2.1
N$57
  Top 0.254: C12.1 IC1.2 | R15.1 C12.1 | C12.1 R16.2
N$60
  Top 0.254: Q2.3 5.08,30.48 R15.2
N$64
  Top 0.254: 67.31,36.2 IC3.5 | C17.1 67.31,36.2 | IC3.7 72.39,36.83 71.75,36.2 67.31,36.2
N$68
  Top 0.254: Q1.3 8.89,55.88 R1.2
N$70
  Top 0.254: IC5.6 109.22,46.99 109.22,50.8 C10.1 107.95,55.88 106.68,57.15 R11.2 100.33,57.15 90.17,46.99 IC4.12
N$82
  Top 0.254: IC7.10 73.66,6.98 75.56,5.08 Q5.1 80.01,5.08 C27.2
N$83
  Top 0.254: IC7.9 71.25,10.03 Q5.2 67.31,5.08 C26.2
OSC
  Top 0.254: IC6.6 41.91,19.05 46.35,22.86 58.42,22.86 60.96,25.4 | 60.96,25.4 76.2,25.4 C22.2 | 60.96,25.4 60.96,29.21 C21.-
OUT  (via drill 0.6)
  Top 0.254: C10.2 R11.1 IC5.7
  Top 0.305: v105.41,40.01 106.68,38.74 106.68,34.29 109.22,31.75 JP1.2
  Bottom 0.305: v105.41,40.01 IC5.7
OUTA
  Top 0.254: JP1.3 111.12,34.29 112.39,35.56 112.39,38.1 114.94,40.64 JP2.6
OUTB
  Top 0.254: JP1.1 111.12,29.21 113.67,31.75 113.67,36.83 114.94,38.1 JP2.5
RES_PWM  (via drill 0.6)
  Top 0.254: v76.2,13.33 75.56,12.7 66.04,12.7 64.77,13.97 22.86,13.97 13.97,22.86 R16.1
  Bottom 0.254: v76.2,13.33 IC7.11
SCK
  Top 0.254: IC7.19 73.66,16.51 75.56,14.61 76.83,14.61 78.74,12.7 95.25,12.7 | 95.25,12.7 100.33,12.7 R38.2 | 95.25,12.7 ISP.3
SS
  Top 0.254: JP3.2 83.82,21.59 81.28,19.05 IC7.16
SSA
  Top 0.254: JP3.3 111.76,24.13 113.03,22.86 JP4.6
SSB
  Top 0.254: JP3.1 111.76,19.05 113.03,20.32 JP4.5
V-REF
  Top 0.254: D1.A R40.1 20.32,25.4 24.13,25.4 | 24.13,25.4 R18.1 | R20.1 35.56,25.4 24.13,25.4
VCA  (via drill 0.6)
  Top 0.254: IC6.8 36.83,19.05 35.56,20.32 18.41,20.32 16.51,22.22 v16.51,27.3 | v15.24,41.91 15.24,55.88 R2.1
  Bottom 0.254: v16.51,27.3 15.24,28.57 v15.24,41.91
VCC  (via drill 0.6)
  Top 0.406: IC4.11 92.71,46.99 96.52,50.8 99.06,50.8 C9.1 102.87,46.99 IC5.8
  Top 0.61: JP2.4 117.47,37.47 117.47,44.45 116.2,45.72 C11.+ 113.03,45.72 109.86,42.55 100.33,42.55 | v19.05,42.55 v45.72,42.55 69.85,42.55 | 69.85,42.55 100.33,42.55 | 69.85,42.55 IC3.11 C8.1 | 100.33,42.55 C9.1 | C13.1 IC1.4 | IC2.11 C6.1
  Bottom 0.61: IC2.11 46.99,44.45 45.72,43.18 v45.72,42.55 | v19.05,42.55 16.51,40.01 IC1.4
VEE  (via drill 0.6)
  Top 0.254: R40.2 54.61,24.13 58.42,27.94 58.42,30.48 57.78,31.11 53.98,31.11 52.07,29.21
  Top 0.406: C16.2 52.07,29.21 R24.1 | v73.66,50.8 73.66,55.88 R10.1 | v50.8,50.8 50.8,55.88 R6.1
  Top 0.61: 92.71,41.28 v73.66,41.28 v71.12,41.28 v50.8,41.28 v48.26,41.28 18.41,41.28 16.51,43.18 IC1.11 C3.2 | 92.71,41.28 IC4.6 C19.2 | JP2.2 114.94,30.48 111.76,27.3 107.95,27.3 C20.- 100.33,41.28 | 92.71,41.28 100.33,41.28 | IC5.4 110.49,40.64 109.86,41.28 100.33,41.28
  Bottom 0.406: C18.2 74.93,29.21 R28.1 | v73.66,41.28 v73.66,50.8 | v50.8,41.28 v50.8,50.8
  Bottom 0.61: v48.26,41.28 48.26,40.64 46.99,39.37 IC2.6 C16.2 | v71.12,41.28 71.12,40.64 69.85,39.37 IC3.6 C18.2

### Text on the board
Top: Mutable Instruments | SMR-4 voicecard
tNames: A | SEL | B | V/Oct | A | SEL | B | NOTE | DATA
tStop: Mutable Instruments | SMR-4 voicecard
200bmp: cc-by-sa | Émilie Gillet | v0.4